# EAGLE design sdls (EAGLE 6.2)
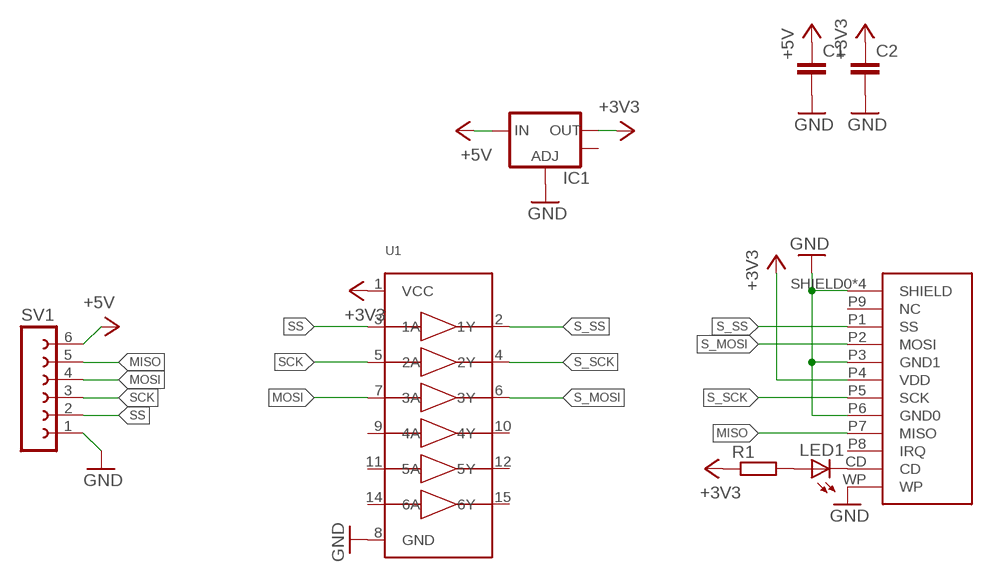
[diagram p0: schematic, sheet 1]

## Parts
C1  C-EUC0805K  [C0805K]
C2  C-EUC0805K  [C0805K]
IC1  V_REG_LM1117SOT223  [SOT223]
LED1  LEDSML0805  [SML0805]
R1  R-EU_R0603  [R0603]
SV1  FE06-1  [FE06]
U1  74HC4050D  [SOIC16]
U$1  SD_CARD  [MEM1055]

## Nets
+3V3: C2.1 IC1.2(OUT) R1.1 U1.1(VCC) U$1.P4(VDD)
+5V: C1.1 IC1.3(IN) SV1.6
GND: C1.2 C2.2 IC1.1(ADJ) SV1.1 U1.8(GND) U$1.P3(GND1) U$1.P6(GND0) U$1.SHIELD0(SHIELD) U$1.SHIELD1(SHIELD) U$1.SHIELD2(SHIELD) U$1.SHIELD3(SHIELD) U$1.WP
MISO: SV1.5 U$1.P7(MISO)
MOSI: SV1.4 U1.7(3A)
N$1: LED1.C U$1.CD
N$2: LED1.A R1.2
S_MOSI: U1.6(3Y) U$1.P2(MOSI)
S_SCK: U1.4(2Y) U$1.P5(SCK)
S_SS: U1.2(1Y) U$1.P1(SS)
SCK: SV1.3 U1.5(2A)
SS: SV1.2 U1.3(1A)
Unconnected: IC1.4(OUT) U1.9(4A) U1.10(4Y) U1.11(5A) U1.12(5Y) U1.14(6A) U1.15(6Y) U$1.P8(IRQ) U$1.P9(NC)

## Library data of the parts
C1 C2 = rcl:C-EU: CAPACITOR, European symbol
IC1 = SparkFun:V_REG_LM1117: Voltage Regulator LM1117 Standard adjustable voltage regulator but in SMD form. Spark Fun Electronics SKU : COM-00595
LED1 = led:LED: LED OSRAM: - CHIPLED LG R971, LG N971, LY N971, LG Q971, LY Q971, LO R971, LY R971 LH N974, LH R974 LS Q976, LO Q976, LY Q976 LO Q996 - Hyper CHIPLED LW Q18S LB Q993, LB Q99A, LB R99A - SideLED LS A670, LO A670, LY A670, LG A670, LP A670 LB A673, LV A673, LT A673, LW A673 LH A674 LY A675 LS A676, LA A676, LO A676, LY A676, LW A676 LS A679, LY A679, LG A679 - Hyper Micro SIDELED® LS Y876, LA Y876, LO Y876, LY Y876 LT Y87S - SmartLED LW L88C, LW L88S LB L89C, LB L89S, LG L890 LS L89K, LO L89K, LY L89K LS L896, LA L896, LO L896, LY L896 - TOPLED LS T670, LO T670, LY T670, LG T670, LP T670 LSG T670, LSP T670, LSY T670, LOP T670, LYG T670 LG T671, LOG T671, LSG T671 LB T673, LV T673, LT T673, LW T673 LH T674 LS T676, LA T676, LO T676, LY T676, LB T676, LH T676, LSB T676, LW T676 LB T67C, LV T67C, LT T67C, LS T67K, LO T67K, LY T67K, LW E67C LS E67B, LA E67B, LO E67B, LY E67B, LB E67C, LV E67C, LT E67C LW T67C LS T679, LY T679, LG T679 LS T770, LO T770, LY T770, LG T770, LP T770 LB T773, LV T773, LT T773, LW T773 LH T774 LS E675, LA E675, LY E675, LS T675 LS T776, LA T776, LO T776, LY T776, LB T776 LHGB T686 LT T68C, LB T68C - Hyper Mini TOPLED® LB M676 - Mini TOPLED Santana® LG M470 LS M47K, LO M47K, LY M47K Source: http://www.osram.convergy.de LUXEON: - LUMILED® LXK2-PW12-R00, LXK2-PW12-S00, LXK2-PW14-U00, LXK2-PW14-V00 LXK2-PM12-R00, LXK2-PM12-S00, LXK2-PM14-U00 LXK2-PE12-Q00, LXK2-PE12-R00, LXK2-PE12-S00, LXK2-PE14-T00, LXK2-PE14-U00 LXK2-PB12-K00, LXK2-PB12-L00, LXK2-PB12-M00, LXK2-PB14-N00, LXK2-PB14-P00, LXK2-PB14-Q00 LXK2-PR12-L00, LXK2-PR12-M00, LXK2-PR14-Q00, LXK2-PR14-R00 LXK2-PD12-Q00, LXK2-PD12-R00, LXK2-PD12-S00 LXK2-PH12-R00, LXK2-PH12-S00 LXK2-PL12-P00, LXK2-PL12-Q00, LXK2-PL12-R00 Source: www.luxeon.com KINGBRIGHT: KA-3528ASYC Source: www.kingbright.com
R1 = rcl:R-EU_: RESISTOR, European symbol
SV1 = con-lsta:FE06-1: FEMALE HEADER; OC_FARNELL: unknown; OC_NEWARK: unknown
U1 = microbuilder:74HC4050D: 6-channel level shifter 74HC4050D - 2V-6V Supply Digikey: 74HC4050D,653-ND Mouser: 771-74HC4050D-T
U$1 = tbsliver-con-memory:SD_CARD

## Board
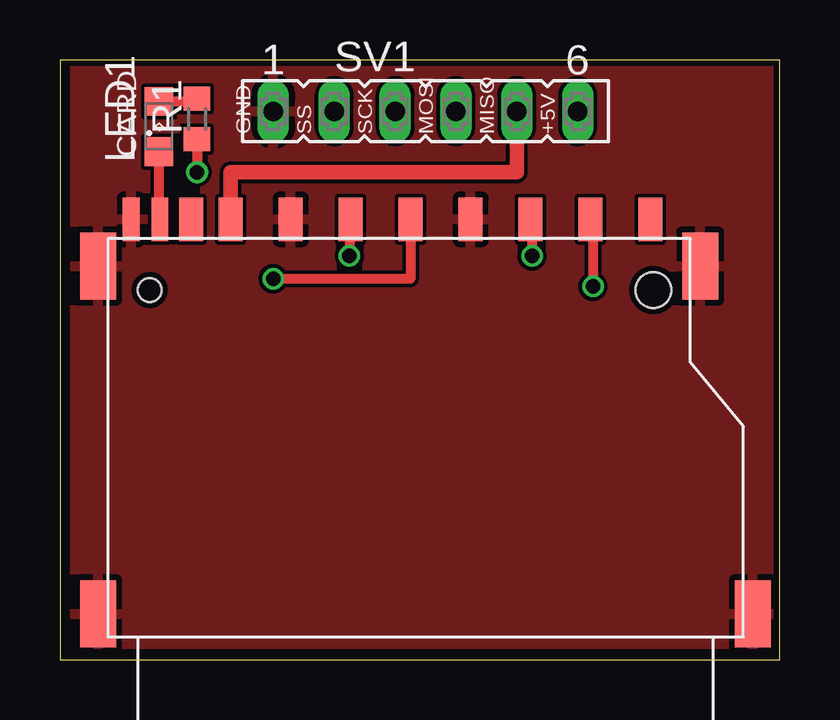
[diagram p1: board, top side]
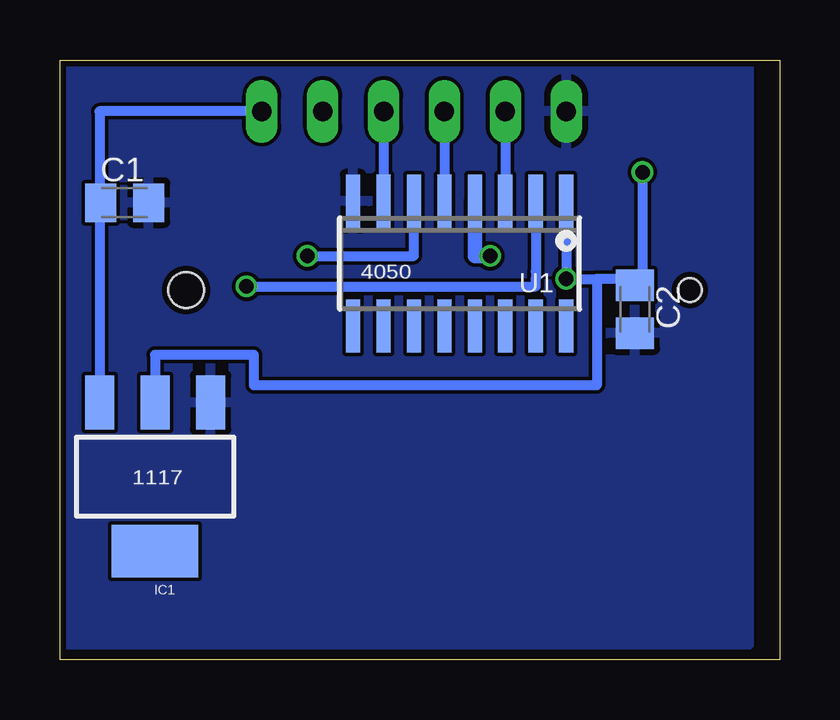
[diagram p2: board, bottom side, seen from below]

Size 30 x 25 mm. Coordinates in mm from the lower left corner, seen from the top.
Outline: 0,0 30,0 30,25 0,25 0,0
Copper layers (1*16): Top 0.035mm / dielectric 1.5mm / Bottom 0.035mm
Design rules: minimum track width 6mil, minimum drill 12mil, track to track 6mil, track to pad 6mil, pad to pad 6mil, via to via 6mil, smd to smd 0mil, copper to edge 10mil, drill to drill 10mil, minimum pad ring 10mil, minimum via ring 6mil, stop-mask expansion 2mil, vias tented up to drill 100mil, thermal gap 10mil

### Footprints (pad centres in the part's own frame; a part is rotated, then mirrored left to right if it is on the bottom)
C0805K = smd 1.3 x 1.6: 1 -1,0; 2 1,0
SOT223 = smd 1.219 x 2.235: 1 -2.311,-3.099; 2 0,-3.099; 3 2.311,-3.099 | smd 3.6 x 2.2: 4 0,3.099
SML0805 = smd 1.2 x 1.2: A 1.05,0; C -1.05,0
R0603 = smd 1 x 1.1: 1 -0.85,0; 2 0.85,0
FE06 = drill 0.813 long: 1 -6.35,0; 2 -3.81,0; 3 -1.27,0; 4 1.27,0; 5 3.81,0; 6 6.35,0
SOIC16 = smd 0.6 x 2.2: 1 -4.445,-2.6; 2 -3.175,-2.6; 3 -1.905,-2.6; 4 -0.635,-2.6; 5 0.635,-2.6; 6 1.905,-2.6; 7 3.175,-2.6; 8 4.445,-2.6; 9 4.445,2.6; 10 3.175,2.6; 11 1.905,2.6; 12 0.635,2.6; 13 -0.635,2.6; 14 -1.905,2.6; 15 -3.175,2.6; 16 -4.445,2.6
MEM1055 = smd 0.7 x 1.8: CD -11.07,16.45; WP -12.27,16.45 | smd 1 x 1.8: P1 6.88,16.45; P2 4.38,16.45; P3 1.88,16.45; P4 -0.63,16.45; P5 -3.12,16.45; P6 -5.62,16.45; P7 -8.12,16.45; P8 -9.77,16.45; P9 9.38,16.45 | smd 1.5 x 2.8: SHIELD0 -13.65,0; SHIELD1 13.65,0; SHIELD2 -13.65,14.5; SHIELD3 11.45,14.5 | hole 1: -11.5,13.5 | hole 1.5: 9.5,13.5

### Placement (x,y rotation side)
C1  27.3,19.05 0 bottom
C2  6.03,14.61 270 bottom
IC1  26.04,7.62 180 bottom
LED1  4.13,22.23 90 top
R1  5.71,22.54 90 top
SV1  15.24,22.86 0 top
U1  13.34,16.51 180 bottom
U$1  15.24,1.91 0 top

### Tracks (layer width: path | path; a pad name or v marks a point on that pad's centre or on a via)
+3V3  (via drill 0.6)
  Top 0.406: U$1.P4 14.61,15.88 v8.89,15.88 | R1.1 v5.71,20.32
  Bottom 0.406: U1.1 v8.89,15.88 7.62,15.88 | 7.62,15.88 7.62,11.43 21.91,11.43 21.91,12.7 26.04,12.7 IC1.2 | v5.71,20.32 5.71,15.88 6.03,15.88 | 6.03,15.88 7.62,15.88 | C2.1 6.03,15.88
+5V
  Bottom 0.406: SV1.6 28.35,22.86 28.35,19.37 28.35,19.05 | 28.35,19.05 IC1.3 | C1.1 28.35,19.05
GND
  pour Top: 0.64,24.77 29.84,24.77 29.84,0.64 0.64,0.64
  pour Bottom: 1.27,24.77 29.84,24.77 29.84,0.64 1.27,0.64
MISO
  Top 0.61: U$1.P7 7.12,20.32 19.05,20.32 SV1.5
MOSI
  Bottom 0.406: SV1.4 U1.7
N$1
  Top 0.406: U$1.CD 4.13,18.36 LED1.C
N$2
  Top 0.406: LED1.A 5.71,23.27 R1.2
S_MOSI  (via drill 0.6)
  Top 0.406: 19.68,18.36 v19.68,16.83
  Top 0.61: U$1.P2 19.68,18.36
  Bottom 0.406: v19.68,16.83 15.24,16.83 U1.6
S_SCK  (via drill 0.6)
  Top 0.406: 12.06,18.36 v12.06,16.83
  Top 0.61: U$1.P5 12.06,18.36
  Bottom 0.61: v12.06,16.83 12.7,16.83 U1.4
S_SS  (via drill 0.6)
  Top 0.406: 22.23,18.36 v22.23,15.56
  Top 0.61: U$1.P1 22.23,18.36
  Bottom 0.406: U1.2 10.16,16.19 10.16,15.88 10.16,15.56 v22.23,15.56
SCK
  Bottom 0.406: SV1.3 U1.5
SS
  Bottom 0.406: SV1.2 U1.3

### Text on the board
_tsilk: GND | SS | SCK | MOSI | MISO | +5V | CARD
_bsilk: 4050 | 1117